# EAGLE design base-6u-generic-xau4 (EAGLE 6.2)
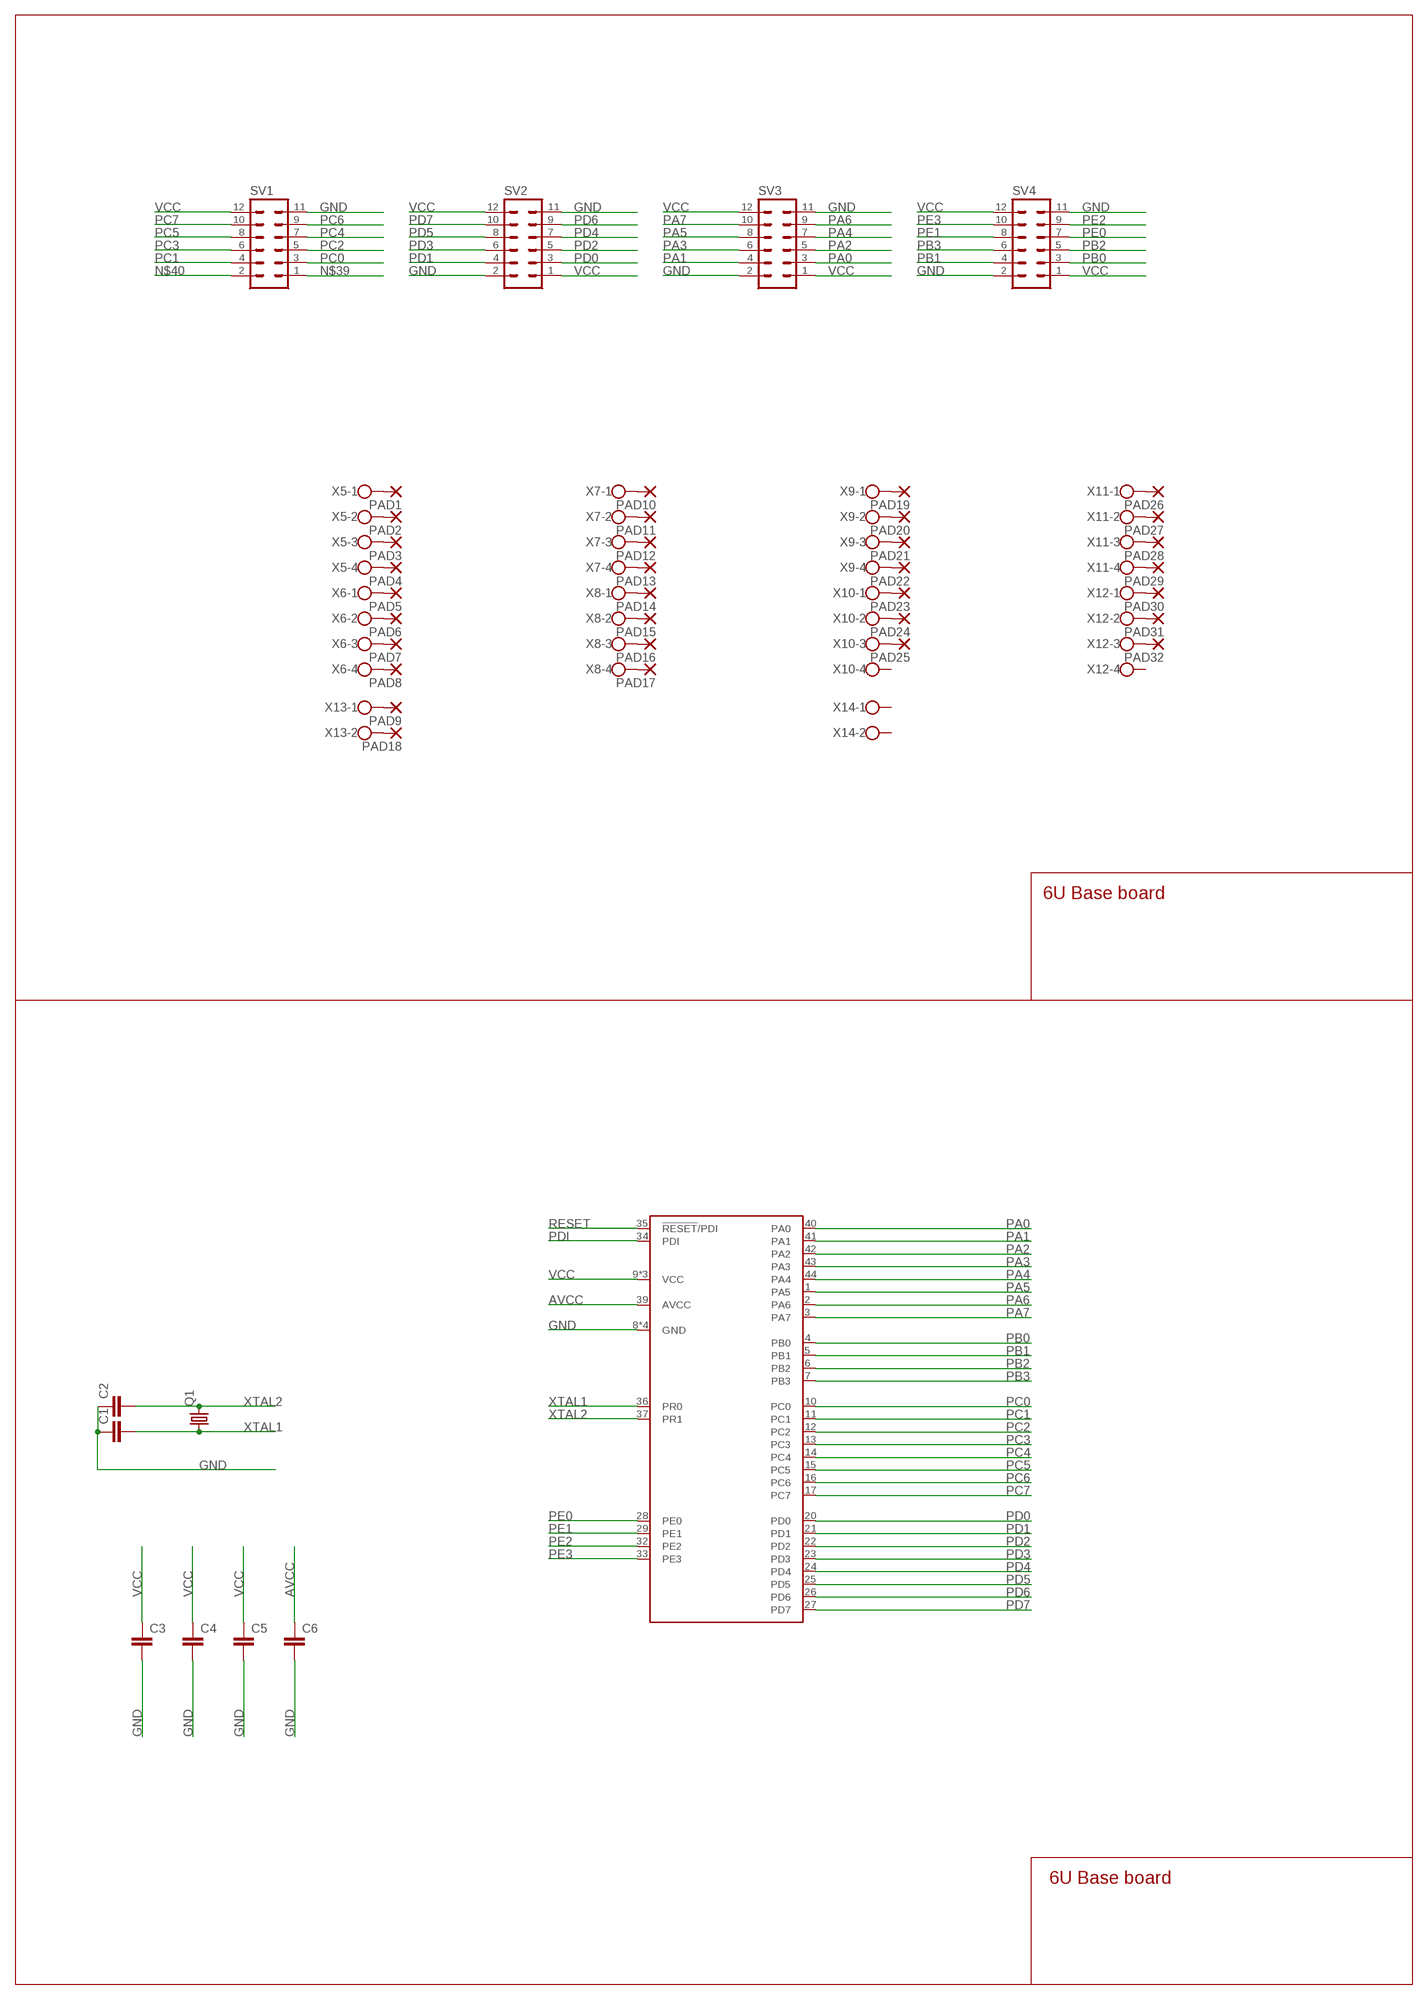
[diagram p0: schematic, sheet 1]

## Parts
C1  C-EUC0805  [C0805]
C2  C-EUC0805  [C0805]
C3  C-EUC0603  [C0603]
C4  C-EUC0603  [C0603]
C5  C-EUC0603  [C0603]
C6  C-EUC0603  [C0603]
PAD1  2,54/0,8  [2,54/0,8]
PAD2  2,54/0,8  [2,54/0,8]
PAD3  2,54/0,8  [2,54/0,8]
PAD4  2,54/0,8  [2,54/0,8]
PAD5  2,54/0,8  [2,54/0,8]
PAD6  2,54/0,8  [2,54/0,8]
PAD7  2,54/0,8  [2,54/0,8]
PAD8  2,54/0,8  [2,54/0,8]
PAD9  2,54/0,8  [2,54/0,8]
PAD10  2,54/0,8  [2,54/0,8]
PAD11  2,54/0,8  [2,54/0,8]
PAD12  2,54/0,8  [2,54/0,8]
PAD13  2,54/0,8  [2,54/0,8]
PAD14  2,54/0,8  [2,54/0,8]
PAD15  2,54/0,8  [2,54/0,8]
PAD16  2,54/0,8  [2,54/0,8]
PAD17  2,54/0,8  [2,54/0,8]
PAD18  2,54/0,8  [2,54/0,8]
PAD19  2,54/0,8  [2,54/0,8]
PAD20  2,54/0,8  [2,54/0,8]
PAD21  2,54/0,8  [2,54/0,8]
PAD22  2,54/0,8  [2,54/0,8]
PAD23  2,54/0,8  [2,54/0,8]
PAD24  2,54/0,8  [2,54/0,8]
PAD25  2,54/0,8  [2,54/0,8]
PAD26  2,54/0,8  [2,54/0,8]
PAD27  2,54/0,8  [2,54/0,8]
PAD28  2,54/0,8  [2,54/0,8]
PAD29  2,54/0,8  [2,54/0,8]
PAD30  2,54/0,8  [2,54/0,8]
PAD31  2,54/0,8  [2,54/0,8]
PAD32  2,54/0,8  [2,54/0,8]
Q1  CRYSTALHC49S  [HC49/S]
SV1  MA06-2  [MA06-2]
SV2  MA06-2  [MA06-2]
SV3  MA06-2  [MA06-2]
SV4  MA06-2  [MA06-2]
U1  ATXMEGA32A4U-AU  [TQFP-44A-44]
X5  W237-4  [W237-4]
X6  W237-4  [W237-4]
X7  W237-4  [W237-4]
X8  W237-4  [W237-4]
X9  W237-4  [W237-4]
X10  W237-4  [W237-4]
X11  W237-4  [W237-4]
X12  W237-4  [W237-4]
X13  W237-102  [W237-102]
X14  W237-102  [W237-102]

## Nets
AVCC: C6.1 U1.39(AVCC)
GND: C1.1 C2.1 C3.2 C4.2 C5.2 C6.2 SV1.11 SV2.2 SV2.11 SV3.2 SV3.11 SV4.2 SV4.11 U1.8(GND) U1.18(GND) U1.30(GND) U1.38(GND)
N$1: PAD1.1(P) X5.1
N$2: PAD2.1(P) X5.2
N$3: PAD3.1(P) X5.3
N$4: PAD4.1(P) X5.4
N$5: PAD5.1(P) X6.1
N$6: PAD6.1(P) X6.2
N$7: PAD7.1(P) X6.3
N$8: PAD8.1(P) X6.4
N$9: PAD9.1(P) X13.1
N$10: PAD10.1(P) X7.1
N$11: PAD11.1(P) X7.2
N$12: PAD12.1(P) X7.3
N$13: PAD13.1(P) X7.4
N$14: PAD14.1(P) X8.1
N$15: PAD15.1(P) X8.2
N$16: PAD16.1(P) X8.3
N$17: PAD17.1(P) X8.4
N$18: PAD18.1(P) X13.2
N$19: PAD26.1(P) X11.1
N$20: PAD27.1(P) X11.2
N$21: PAD28.1(P) X11.3
N$22: PAD29.1(P) X11.4
N$23: PAD30.1(P) X12.1
N$24: PAD31.1(P) X12.2
N$25: PAD32.1(P) X12.3
N$26: PAD19.1(P) X9.1
N$27: PAD20.1(P) X9.2
N$28: PAD21.1(P) X9.3
N$29: PAD22.1(P) X9.4
N$30: PAD23.1(P) X10.1
N$31: PAD24.1(P) X10.2
N$32: PAD25.1(P) X10.3
N$39: SV1.1
N$40: SV1.2
PA0: SV3.3 U1.40(PA0)
PA1: SV3.4 U1.41(PA1)
PA2: SV3.5 U1.42(PA2)
PA3: SV3.6 U1.43(PA3)
PA4: SV3.7 U1.44(PA4)
PA5: SV3.8 U1.1(PA5)
PA6: SV3.9 U1.2(PA6)
PA7: SV3.10 U1.3(PA7)
PB0: SV4.3 U1.4(PB0)
PB1: SV4.4 U1.5(PB1)
PB2: SV4.5 U1.6(PB2)
PB3: SV4.6 U1.7(PB3)
PC0: SV1.3 U1.10(PC0)
PC1: SV1.4 U1.11(PC1)
PC2: SV1.5 U1.12(PC2)
PC3: SV1.6 U1.13(PC3)
PC4: SV1.7 U1.14(PC4)
PC5: SV1.8 U1.15(PC5)
PC6: SV1.9 U1.16(PC6)
PC7: SV1.10 U1.17(PC7)
PD0: SV2.3 U1.20(PD0)
PD1: SV2.4 U1.21(PD1)
PD2: SV2.5 U1.22(PD2)
PD3: SV2.6 U1.23(PD3)
PD4: SV2.7 U1.24(PD4)
PD5: SV2.8 U1.25(PD5)
PD6: SV2.9 U1.26(PD6)
PD7: SV2.10 U1.27(PD7)
PDI: U1.34(PDI)
PE0: SV4.7 U1.28(PE0)
PE1: SV4.8 U1.29(PE1)
PE2: SV4.9 U1.32(PE2)
PE3: SV4.10 U1.33(PE3)
RESET: U1.35(!RESET!/PDI)
VCC: C3.1 C4.1 C5.1 SV1.12 SV2.1 SV2.12 SV3.1 SV3.12 SV4.1 SV4.12 U1.9(VCC) U1.19(VCC) U1.31(VCC)
XTAL1: C1.2 Q1.1 U1.36(PR0)
XTAL2: C2.2 Q1.2 U1.37(PR1)
Unconnected: X10.4 X12.4 X14.1 X14.2

## Notes on the sheet
- 6U Base board
- 6U Base board

## Library data of the parts
C1-C6 = rcl:C-EU: CAPACITOR, European symbol
PAD1-PAD32 = wirepad:2,54/0,8: THROUGH-HOLE PAD
Q1 = crystal:CRYSTAL: CRYSTAL
SV1-SV4 = con-lstb:MA06-2: PIN HEADER; OC_FARNELL: unknown; OC_NEWARK: unknown
U1 = atmel-xmega:ATXMEGA32A4U: 8/16-bit XMEGA A4U Microcontroller Features High-performance, low-power Atmel® AVR® XMEGA® 8/16-bit Microcontroller Nonvolatile program and data memories – 16K - 128KBytes of in-system self-programmable flash – 4K - 8KBytes boot section – 1K - 2KBytes EEPROM – 2K - 8KBytes internal SRAM Peripheral Features – Four-channel DMA controller – Eight-channel event system – Five 16-bit timer/counters Three timer/counters with 4 output compare or input capture channels Two timer/counters with 2 output compare or input capture channels High-resolution extensions on all timer/counters Advanced waveform extension (AWeX) on one timer/counter – One USB device interface USB 2.0 full speed (12Mbps) and low speed (1.5Mbps) device compliant 32 Endpoints with full configuration flexibility – Five USARTs with IrDA support for one USART – Two Two-wire interfaces with dual address match (I2C and SMBus compatible) – Two serial peripheral interfaces (SPIs) – AES and DES crypto engine – CRC-16 (CRC-CCITT) and CRC-32 (IEEE® 802.3) generator – 16-bit real time counter (RTC) with separate oscillator – One twelve-channel, 12-bit, 2mspsAnalog to Digital Converter – One two-channel, 12-bit, 1msps Digital to Analog Converter – Two Analog Comparators with window compare function, and current sources – External interrupts on all general purpose I/O pins – Programmable watchdog timer with separate on-chip ultra low power oscillator – QTouch® library support Capacitive touch buttons, sliders and wheels Special microcontroller features – Power-on reset and programmable brown-out detection – Internal and external clock options with PLL and prescaler – Programmable multilevel interrupt controller – Five sleep modes – Programming and debug interfaces PDI (program and debug interface) I/O and packages – 34 Programmable I/O pins – 44 - lead TQFP – 44 - pad VQFN/QFN – 49 - ball VFBGA Operating voltage – 1.6 – 3.6V Operating frequency – 0 – 12MHz from 1.6V – 0 – 32MHz from 2.7V
X5-X12 = con-wago-500:W237-4: WAGO SCREW CLAMP; OC_FARNELL: unknown; OC_NEWARK: unknown
X13 X14 = con-wago-500:W237-102: WAGO SCREW CLAMP; MPN: 237-102; OC_FARNELL: unknown; OC_NEWARK: 70K9898

## Board
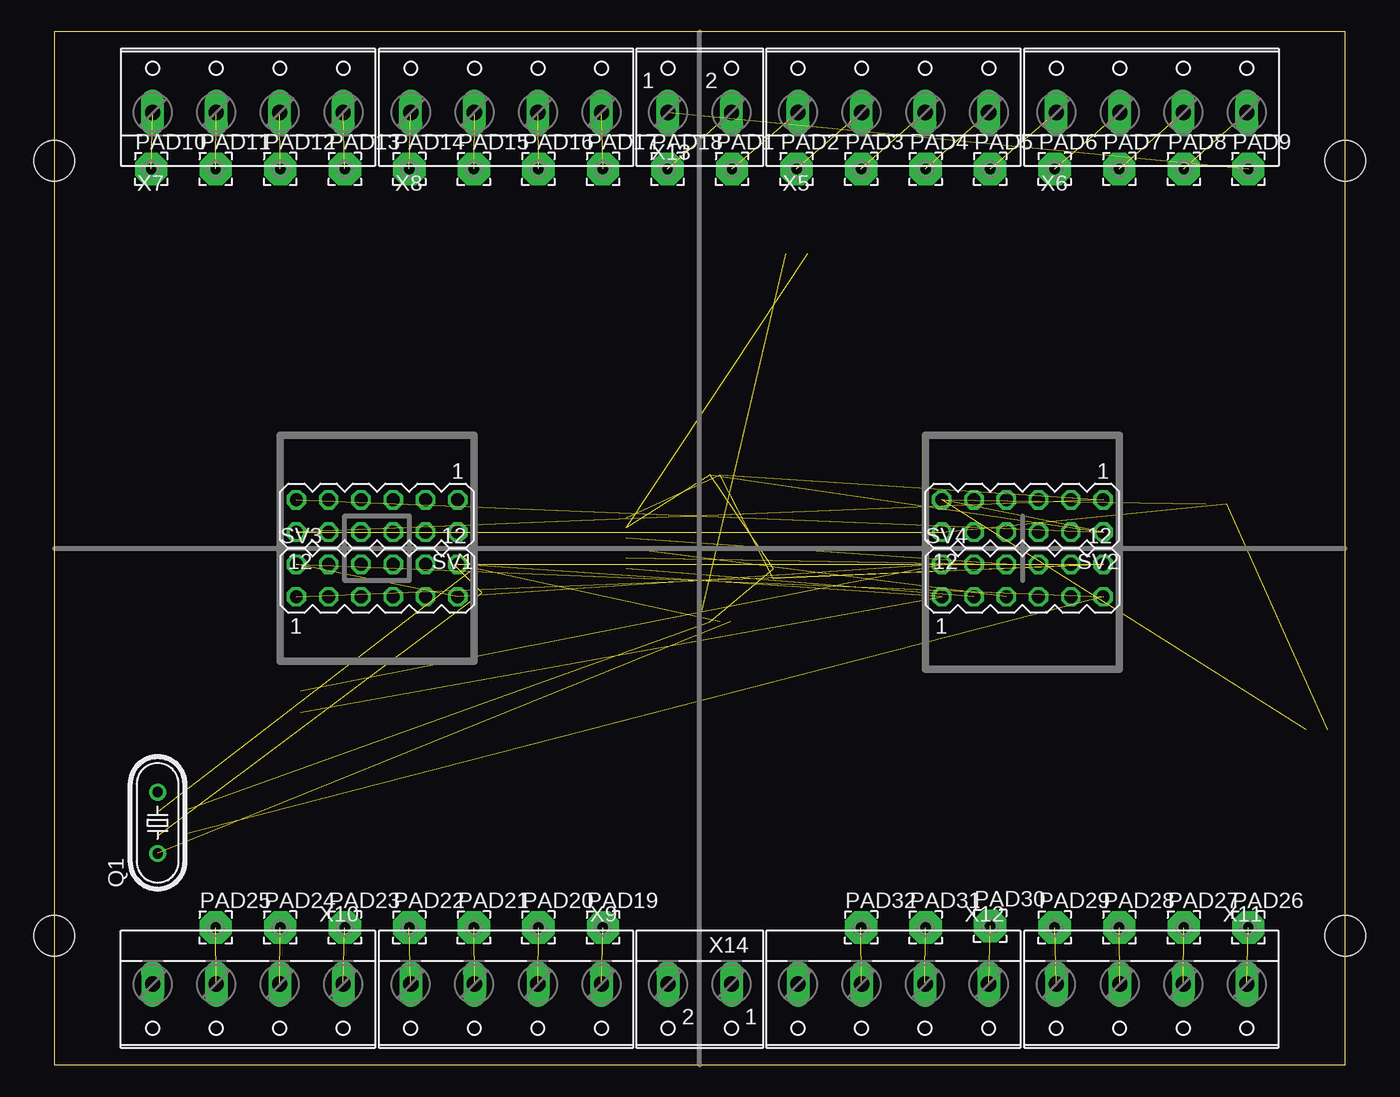
[diagram p1: board, top side]
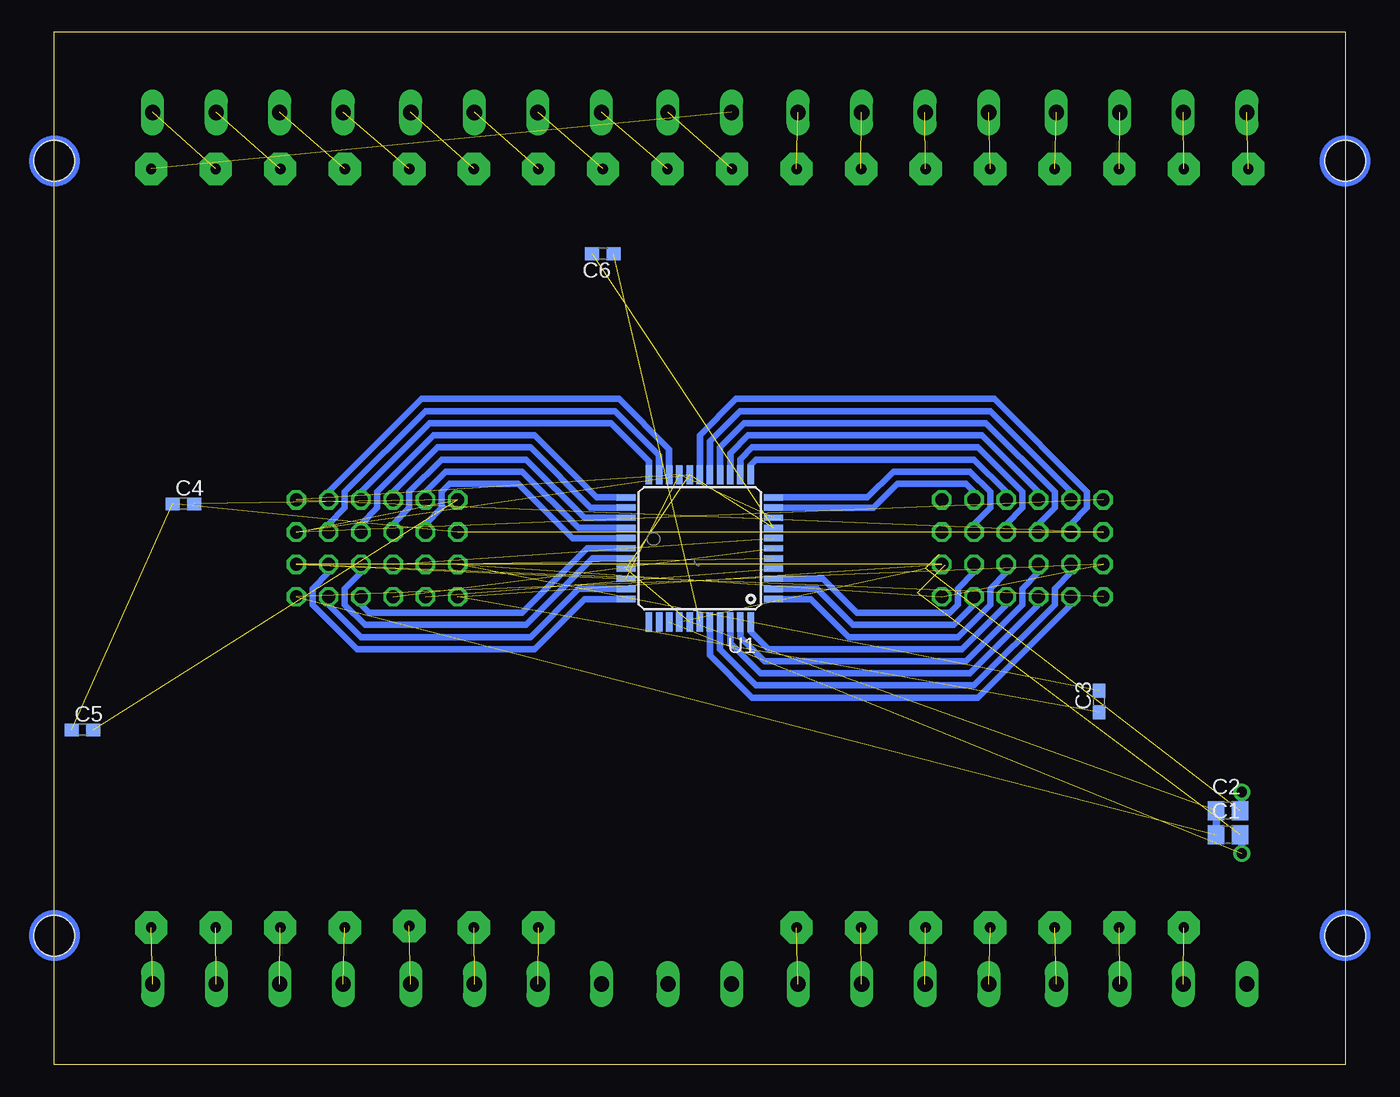
[diagram p2: board, bottom side, seen from below]

Size 101.6 x 81.28 mm. Coordinates in mm from the lower left corner, seen from the top.
Outline: 0,0.01 101.6,0 101.6,81.28 0,81.28 0,0.01
Copper layers (1*16): Top 0.035mm / dielectric 1.5mm / Bottom 0.035mm
Design rules: minimum track width 10mil, minimum drill 24mil, track to track 8mil, track to pad 8mil, pad to pad 8mil, via to via 8mil, smd to smd 8mil, copper to edge 40mil, drill to drill 8mil, minimum pad ring 10mil, minimum via ring 8mil, stop-mask expansion 4mil, vias tented up to drill 0mil, thermal gap 10mil
Holes 3.2 mm at 0,10.16 0,71.12 101.6,10.16 101.6,71.12
bRestrict: area -3.8,6.3 to 3.8,14; area 97.8,6.3 to 105.4,14; area -3.8,67.3 to 3.8,74.9; area 97.8,67.3 to 105.4,74.9

### Footprints (pad centres in the part's own frame; a part is rotated, then mirrored left to right if it is on the bottom)
C0805 = smd 1.3 x 1.5: 1 -0.95,0; 2 0.95,0
C0603 = smd 1.1 x 1: 1 -0.85,0; 2 0.85,0
2,54/0,8 = drill 0.813 pad 2.54 octagon: 1 0,0
HC49/S = drill 0.813: 1 -2.413,0; 2 2.413,0
MA06-2 = drill 1.016 octagon: 1 -6.35,-1.27; 2 -6.35,1.27; 3 -3.81,-1.27; 4 -3.81,1.27; 5 -1.27,-1.27; 6 -1.27,1.27; 7 1.27,-1.27; 8 1.27,1.27; 9 3.81,-1.27; 10 3.81,1.27; 11 6.35,-1.27; 12 6.35,1.27
TQFP-44A-44 = smd 1.5 x 0.5: 1 -5.8,4; 2 -5.8,3.2; 3 -5.8,2.4; 4 -5.8,1.6; 5 -5.8,0.8; 6 -5.8,0; 7 -5.8,-0.8; 8 -5.8,-1.6; 9 -5.8,-2.4; 10 -5.8,-3.2; 11 -5.8,-4; 23 5.8,-4; 24 5.8,-3.2; 25 5.8,-2.4; 26 5.8,-1.6; 27 5.8,-0.8; 28 5.8,0; 29 5.8,0.8; 30 5.8,1.6; 31 5.8,2.4; 32 5.8,3.2; 33 5.8,4 | smd 0.5 x 1.5: 12 -4,-5.8; 13 -3.2,-5.8; 14 -2.4,-5.8; 15 -1.6,-5.8; 16 -0.8,-5.8; 17 0,-5.8; 18 0.8,-5.8; 19 1.6,-5.8; 20 2.4,-5.8; 21 3.2,-5.8; 22 4,-5.8; 34 4,5.8; 35 3.2,5.8; 36 2.4,5.8; 37 1.6,5.8; 38 0.8,5.8; 39 0,5.8; 40 -0.8,5.8; 41 -1.6,5.8; 42 -2.4,5.8; 43 -3.2,5.8; 44 -4,5.8
W237-4 = drill 1.194 long: 1 -7.5,-1.27; 2 -2.5,-1.27; 3 2.5,-1.27; 4 7.5,-1.27
W237-102 = drill 1.194 long: 1 -2.5,-1.27; 2 2.5,-1.27

### Placement (x,y rotation side)
C1  9.21,18.1 0 bottom
C2  9.21,20 0 bottom
C3  19.37,28.57 90 bottom
C4  91.44,44.13 0 bottom
C5  99.38,26.35 0 bottom
C6  58.42,63.82 180 bottom
PAD1  53.34,70.48 0 top
PAD2  58.42,70.48 0 top
PAD3  63.5,70.48 0 top
PAD4  68.58,70.48 0 top
PAD5  73.66,70.48 0 top
PAD6  78.74,70.48 0 top
PAD7  83.82,70.48 0 top
PAD8  88.9,70.48 0 top
PAD9  93.98,70.48 0 top
PAD10  7.62,70.48 0 top
PAD11  12.7,70.48 0 top
PAD12  17.78,70.48 0 top
PAD13  22.86,70.48 0 top
PAD14  27.94,70.48 0 top
PAD15  33.02,70.48 0 top
PAD16  38.1,70.48 0 top
PAD17  43.18,70.48 0 top
PAD18  48.26,70.48 0 top
PAD19  43.18,10.79 0 top
PAD20  38.1,10.79 0 top
PAD21  33.02,10.79 0 top
PAD22  27.94,10.79 0 top
PAD23  22.86,10.79 0 top
PAD24  17.78,10.79 0 top
PAD25  12.7,10.79 0 top
PAD26  93.98,10.79 0 top
PAD27  88.9,10.79 0 top
PAD28  83.82,10.79 0 top
PAD29  78.74,10.79 0 top
PAD30  73.66,10.92 0 top
PAD31  68.58,10.79 0 top
PAD32  63.5,10.79 0 top
Q1  8.13,19.04 90 top
SV1  25.4,43.18 180 top
SV2  76.2,43.18 180 top
SV3  25.4,38.1 0 top
SV4  76.2,38.1 0 top
U1  50.8,40.64 180 bottom
X5  66.04,76.2 0 top
X6  86.36,76.2 0 top
X7  15.24,76.2 0 top
X8  35.56,76.2 0 top
X9  35.56,5.08 180 top
X10  15.24,5.08 180 top
X11  86.36,5.08 180 top
X12  66.04,5.08 180 top
X13  50.8,76.2 0 top
X14  50.8,5.08 180 top

### Tracks (layer width: path | path; a pad name or v marks a point on that pad's centre or on a via)
AVCC  (1 unrouted)
GND  (15 unrouted)
  Bottom 0.61: C1.1 C2.1
N$1  (1 unrouted)
N$2  (1 unrouted)
N$3  (1 unrouted)
N$4  (1 unrouted)
N$5  (1 unrouted)
N$6  (1 unrouted)
N$7  (1 unrouted)
N$8  (1 unrouted)
N$9  (1 unrouted)
N$10  (1 unrouted)
N$11  (1 unrouted)
N$12  (1 unrouted)
N$13  (1 unrouted)
N$14  (1 unrouted)
N$15  (1 unrouted)
N$16  (1 unrouted)
N$17  (1 unrouted)
N$18  (1 unrouted)
N$19  (1 unrouted)
N$20  (1 unrouted)
N$21  (1 unrouted)
N$22  (1 unrouted)
N$23  (1 unrouted)
N$24  (1 unrouted)
N$25  (1 unrouted)
N$26  (1 unrouted)
N$27  (1 unrouted)
N$28  (1 unrouted)
N$29  (1 unrouted)
N$30  (1 unrouted)
N$31  (1 unrouted)
N$32  (1 unrouted)
PA0
  Bottom 0.508: U1.40 50,32.22 46.68,28.89 28.9,28.89 21.59,36.2 SV3.3
PA1
  Bottom 0.508: U1.41 49.2,32.69 46.36,29.84 29.21,29.84 22.86,36.2 22.86,37.47 21.59,38.73 SV3.4
PA2
  Bottom 0.508: U1.42 48.4,33.16 46.04,30.8 29.53,30.8 24.13,36.2 SV3.5
PA3
  Bottom 0.508: U1.43 47.6,33.63 45.72,31.75 29.85,31.75 25.4,36.2 25.4,37.47 24.13,38.73 SV3.6
PA4
  Bottom 0.508: U1.44 46.8,34.1 45.41,32.7 30.17,32.7 26.67,36.2 SV3.7
PA5
  Bottom 0.508: U1.1 42.04,36.64 39.06,33.66 30.48,33.66 27.94,36.2 27.94,37.47 26.67,38.73 SV3.8
PA6
  Bottom 0.508: U1.2 41.57,37.44 38.74,34.61 30.8,34.61 29.21,36.2 SV3.9
PA7
  Bottom 0.508: SV3.10 29.21,38.73 30.48,37.47 30.48,36.2 31.12,35.56 38.42,35.56 41.1,38.24 U1.3
PB0  (1 unrouted)
PB1  (1 unrouted)
PB2  (1 unrouted)
PB3  (1 unrouted)
PC0
  Bottom 0.508: U1.10 37.13,43.84 35.25,45.72 29.85,45.72 29.21,45.09 SV1.3
PC1
  Bottom 0.508: U1.11 37.6,44.64 35.56,46.67 29.53,46.67 27.94,45.09 27.94,43.81 29.21,42.55 SV1.4
PC2
  Bottom 0.508: U1.12 46.8,47.18 46.36,47.62 29.21,47.62 26.67,45.09 SV1.5
PC3
  Bottom 0.508: U1.13 47.6,47.65 46.68,48.58 28.9,48.58 25.4,45.09 25.4,43.81 26.67,42.55 SV1.6
PC4
  Bottom 0.508: U1.14 48.4,48.12 46.99,49.53 28.58,49.53 24.13,45.09 SV1.7
PC5
  Bottom 0.508: U1.15 49.2,48.59 47.31,50.48 28.26,50.48 22.86,45.09 22.86,43.81 24.13,42.55 SV1.8
PC6
  Bottom 0.508: U1.16 50,49.06 47.63,51.44 27.94,51.44 21.59,45.09 SV1.9
PC7
  Bottom 0.508: U1.17 50.8,49.53 47.95,52.39 27.63,52.39 20.32,45.09 20.32,43.81 21.59,42.55 SV1.10
PD0
  Bottom 0.508: U1.20 53.2,48.44 57.15,52.39 72.71,52.39 80.01,45.09 SV2.3
PD1
  Bottom 0.508: U1.21 54,47.97 57.47,51.44 72.39,51.44 78.74,45.09 78.74,43.81 80.01,42.55 SV2.4
PD2
  Bottom 0.508: U1.22 54.8,47.5 57.79,50.48 72.08,50.48 77.47,45.09 SV2.5
PD3
  Bottom 0.508: U1.23 58.93,44.64 63.82,49.53 71.76,49.53 76.2,45.09 76.2,43.81 77.47,42.55 SV2.6
PD4
  Bottom 0.508: U1.24 59.4,43.84 64.14,48.58 71.44,48.58 74.93,45.09 SV2.7
PD5
  Bottom 0.508: U1.25 59.87,43.04 64.46,47.62 71.12,47.62 73.66,45.09 73.66,43.81 74.93,42.55 SV2.8
PD6
  Bottom 0.508: U1.26 60.34,42.24 64.77,46.67 70.81,46.67 72.39,45.09 SV2.9
PD7
  Bottom 0.508: U1.27 60.81,41.44 65.09,45.72 70.49,45.72 71.12,45.09 71.12,43.81 72.39,42.55 SV2.10
PE0
  Bottom 0.508: U1.28 59.69,40.64 64.77,35.56 76.84,35.56 77.47,36.2 SV4.7
PE1
  Bottom 0.508: U1.29 59.22,39.84 64.46,34.61 77.16,34.61 78.74,36.2 78.74,37.47 77.47,38.73 SV4.8
PE2
  Bottom 0.508: U1.32 60.35,37.44 64.14,33.66 77.47,33.66 80.01,36.2 SV4.9
PE3
  Bottom 0.508: U1.33 59.88,36.64 63.82,32.7 77.79,32.7 81.28,36.2 81.28,37.47 80.01,38.73 SV4.10
VCC  (12 unrouted)
XTAL1  (3 unrouted)
  Bottom 0.61: Q1.1 8.13,17.97 C1.2 | C1.2
XTAL2  (3 unrouted)
  Bottom 0.61: Q1.2 8.13,20.13 C2.2 | C2.2
(copper drawn outside any net)
  shapes: Bottom circle x4

### Text on the board
tDocu: ERRORS